# Altium schematic sheet Sheet1.SchDoc
size A3; SheetNumber: 2; SheetTotal: 2; SPICEModelCacheLIFYFCGV: <root> / <DocumentId>LIFYFCGV</DocumentId> / </root>
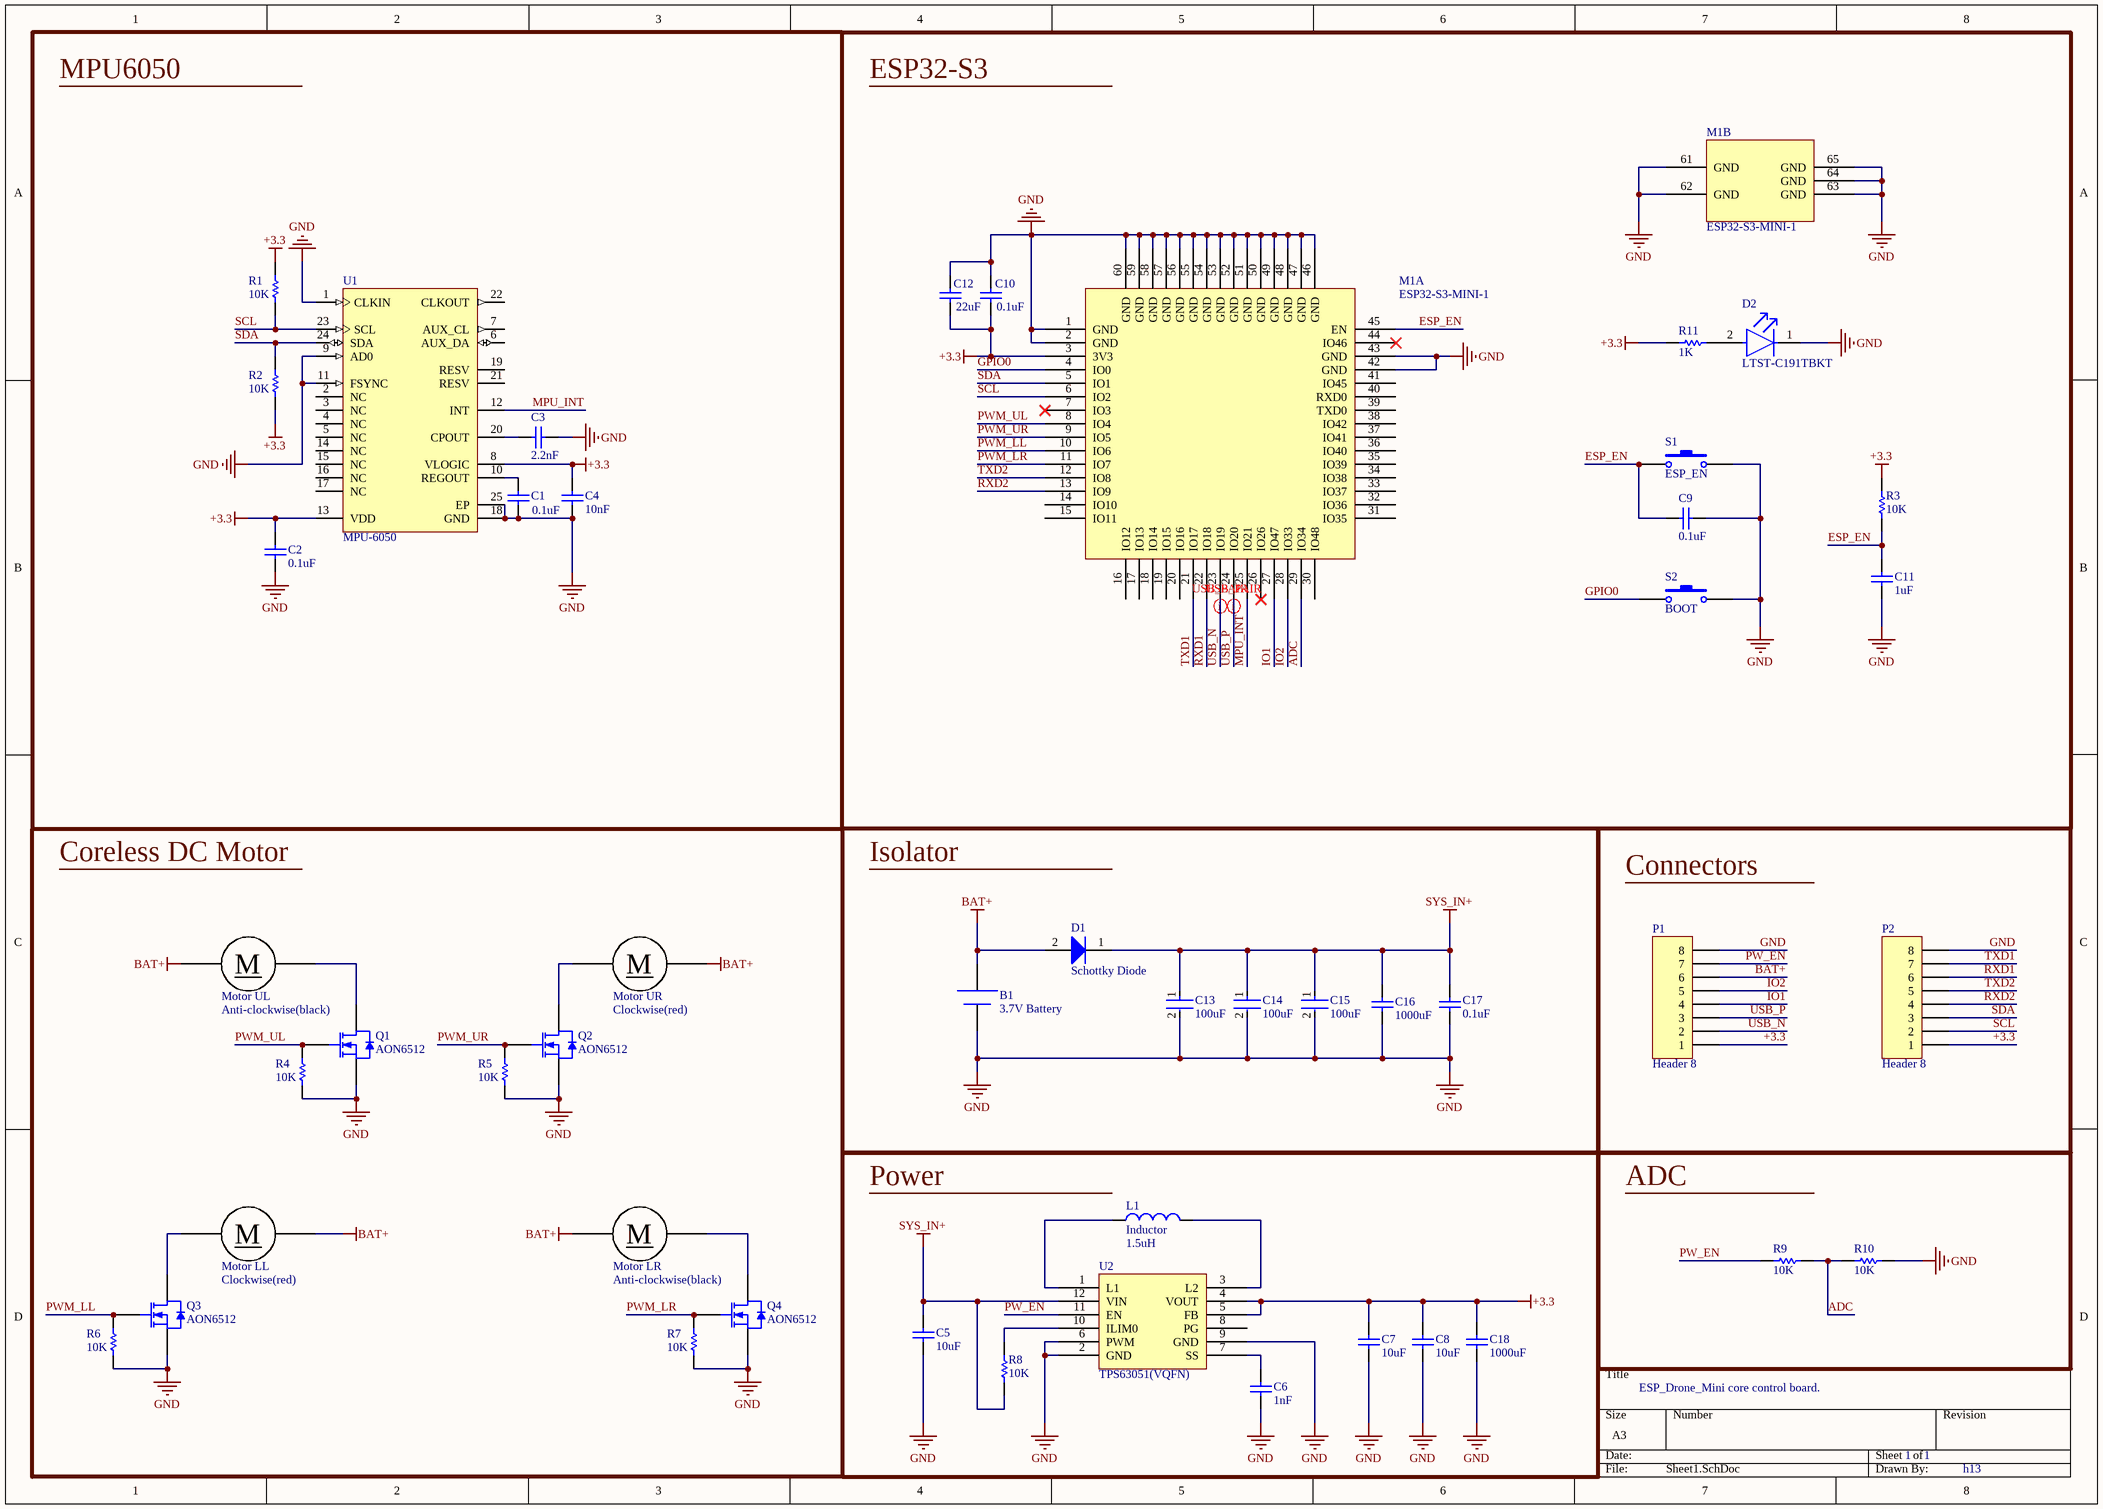
[diagram p0: Sheet1.SchDoc]

## Parts
B1  3.7V Battery  [51005 SMT 2Pin]
C1  0.1uF  [CAPC2013X94X50LL20T25]
C2  0.1uF  [CAPC2013X94X50LL20T25]
C3  2.2nF  [CAPC2013X94X50LL20T25]
C4  10nF  [CAPC2013X94X50LL20T25]
C5  10uF  [CAPC2013X94X50LL20T25]
C6  1nF  [CAPC2013X94X50LL20T25]
C7  10uF  [CAPC2013X94X50LL20T25]
C8  10uF  [CAPC2013X94X50LL20T25]
C9  0.1uF  [CAPC2013X94X50LL20T25]
C10  0.1uF  [CAPC2013X94X50LL20T25]
C11  1uF  [CAPC2013X94X50LL20T25]
C12  22uF  [CAPC2013X94X50LL20T25]
C13  100uF  [FP-C1210C107M9PACTU-MFG]
C14  100uF  [FP-C1210C107M9PACTU-MFG]
C15  100uF  [FP-C1210C107M9PACTU-MFG]
C16  value 1000uF  [SMD-EC8X8X10]  (hidden comment: Cap)
C17  0.1uF  [CAPC2013X94X50LL20T25]
C18  value 1000uF  [SMD-EC8X8X10]  (hidden comment: Cap)
D1  Schottky Diode  [ONSC-SOD-123-2-425-04_V]
D2  LTST-C191TBKT  [FP-LTST-C191TBKT-MFG]
L1  Inductor  value 1.5uH  [4020]
M1  ESP32-S3-MINI-1  [PCBComponent_1]  (parts A,B of 2)
Motor_LL  Motor DC  [HDR1X2]  (value not drawn)
Motor_LR  Motor DC  [HDR1X2]  (value not drawn)
Motor_UL  Motor DC  [HDR1X2]  (value not drawn)
Motor_UR  Motor DC  [HDR1X2]  (value not drawn)
P1  Header 8  [HDR1X8]
P2  Header 8  [HDR1X8]
Q1  AON6512  [AON6512]
Q2  AON6512  [AON6512]
Q3  AON6512  [AON6512]
Q4  AON6512  [AON6512]
R1  10K  [RESC2013X60X40LL20T25_A]
R2  10K  [RESC2013X60X40LL20T25_A]
R3  10K  [RESC2013X60X40LL20T25_A]
R4  10K  [RESC2013X60X40LL20T25_A]
R5  10K  [RESC2013X60X40LL20T25_A]
R6  10K  [RESC2013X60X40LL20T25_A]
R7  10K  [RESC2013X60X40LL20T25_A]
R8  10K  [RESC2013X60X40LL20T25_A]
R9  10K  [RESC2013X60X40LL20T25_A]
R10  10K  [RESC2013X60X40LL20T25_A]
R11  1K  [RESC2013X60X40LL20T25_A]
S1  ESP_EN  [Button SMT 3.9*2.9]
S2  BOOT  [Button SMT 3.9*2.9]
U1  MPU-6050  [IS-QFN-24_V]
U2  TPS63051(VQFN)  [RMW0012A]

## Blocks framed on the sheet
MPU6050: C1-C4 R1 R2 U1
ESP32-S3: C9-C12 D2 M1 R3 R11 S1 S2
Coreless DC Motor: Motor_LL Motor_LR Motor_UL Motor_UR Q1-Q4 R4-R7
Isolator: B1 C13-C17 D1
Connectors: P1 P2
Power: C5-C8 C18 L1 R8 U2
ADC: R9 R10

## Nets
+3.3: C2.1 C4.1 C7.2 C8.2 C10.2 C12.2 C18.1 M1.3(3V3) P1.1 P2.1 R1.2 R2.2 R3.1 R11.1 U1.8(VLOGIC) U1.13(VDD) U2.4(VOUT) U2.5(FB)
BAT+: B1.1(+) D1.2(A) Motor_LL.2 Motor_LR.1 Motor_UL.1 Motor_UR.2 P1.6
GND: B1.2(-) C1.2 C2.2 C3.1 C4.2 C5.1 C6.1 C7.1 C8.1 C9.1 C10.1 C11.2 C12.1 C13.2 C14.2 C15.2 C16.2 C17.2 C18.2 D2.1(C) M1.1(GND) M1.2(GND) M1.42(GND) M1.43(GND) M1.46(GND) M1.47(GND) M1.48(GND) M1.49(GND) M1.50(GND) M1.51(GND) M1.52(GND) M1.53(GND) M1.54(GND) M1.55(GND) M1.56(GND) M1.57(GND) M1.58(GND) M1.59(GND) M1.60(GND) M1.61(GND) M1.62(GND) M1.63(GND) M1.64(GND) M1.65(GND) P1.8 P2.8 Q1.3(SOURCE) Q2.3(SOURCE) Q3.3(SOURCE) Q4.3(SOURCE) R4.1 R5.1 R6.1 R7.1 R10.1 S1.2 S2.2 U1.1(CLKIN) U1.9(AD0) U1.11(FSYNC) U1.18(GND) U1.25(EP) U2.2(GND) U2.6(PWM) U2.9(GND)
SYS_IN+: C5.2 C13.1 C14.1 C15.1 C16.1 C17.1 D1.1(K) R8.1 U2.12(VIN)
ADC: M1.29(IO34) R9.1 R10.2
ESP_EN: C9.2 C11.1 M1.45(EN) R3.2 S1.1
GPIO0: M1.4(IO0) S2.1
IO1: M1.27(IO47) P1.4
IO2: M1.28(IO33) P1.5
MPU_INT: M1.25(IO21) U1.12(INT)
PW_EN: P1.7 R9.2 U2.11(EN)
PWM_LL: M1.10(IO6) Q3.1(GATE) R6.2
PWM_LR: M1.11(IO7) Q4.1(GATE) R7.2
PWM_UL: M1.8(IO4) Q1.1(GATE) R4.2
PWM_UR: M1.9(IO5) Q2.1(GATE) R5.2
RXD1: M1.22(IO18) P2.6
RXD2: M1.13(IO9) P2.4
SCL: M1.6(IO2) P2.2 R1.1 U1.23(SCL)
SDA: M1.5(IO1) P2.3 R2.1 U1.24(SDA)
TXD1: M1.21(IO17) P2.7
TXD2: M1.12(IO8) P2.5
USB_N: M1.23(IO19) P1.2
USB_P: M1.24(IO20) P1.3
NetC1_1: C1.1 U1.10(REGOUT)
NetC3_2: C3.2 U1.20(CPOUT)
NetC6_2: C6.2 U2.7(SS)
NetD2_2: D2.2(A) R11.2
NetL1_1: L1.1 U2.1(L1)
NetL1_2: L1.2 U2.3(L2)
NetMotor_LL_1: Motor_LL.1 Q3.2(DRAIN)
NetMotor_LR_2: Motor_LR.2 Q4.2(DRAIN)
NetMotor_UL_2: Motor_UL.2 Q1.2(DRAIN)
NetMotor_UR_1: Motor_UR.1 Q2.2(DRAIN)
NetR8_2: R8.2 U2.10(ILIM0)

Not connected (* = marked no-connect by the designer): M1 7(IO3)* 14(IO10) 15(IO11) 16(IO12) 17(IO13) 18(IO14) 19(IO15) 20(IO16) 26(IO26)* 30(IO48) 31(IO35) 32(IO36) 33(IO37) 34(IO38) 35(IO39) 36(IO40) 37(IO41) 38(IO42) 39(TXD0) 40(RXD0) 41(IO45) 44(IO46)*; U1 2(NC) 3(NC) 4(NC) 5(NC) 6(AUX_DA) 7(AUX_CL) 14(NC) 15(NC) 16(NC) 17(NC) 19(RESV) 21(RESV) 22(CLKOUT); U2 8(PG)

## Layout directives
differential pair: USB_N, USB_P

## Notes on the sheet
- (near Q1) Anti-clockwise(black)
- Clockwise(red)
- (near Q4) Anti-clockwise(black)
- ESP_Drone_Mini core control board.
- 1
- h13
- (in symbol Motor DC) M

## Library data of the parts
B1 = Battery: 3.7V; pin to pad: 1>2 2>1
C1-C12 C17 = CMP-2007-04184-1: Part Number: 08051C222JAT2A; Manufacturer: AVX Interconnect / Elco
C13-C15 = CMP-2000-06018-2: CAP CER 100UF 6.3V X5R 1210; Dissipation Factor: 5%; Dielectric Material: Ceramic; Tolerance: 20%; Termination: SMD/SMT; REACH SVHC: No SVHC; Thickness: 0.11inch; Packaging: Tape and Reel; Series: C; Width: 2.5mm; Voltage Rating (DC): 6.3V; Voltage: 6.3V; Contact Plating: Tin; Package Quantity: 1; Case/Package: 1210; Min Operating Temperature: -55°C; Height: 2.5mm; Radiation Hardening: No; Capacitance: 100uF; Case Code (Metric): 3225; Depth: 2.5mm; Construction: Flat; Max Operating Temperature: 85°C; Number of Pins: 2; Mount: Surface Mount; Lead Free: Lead Free; RoHS Compliant: Yes; Voltage Rating: 6.3V; Dielectric: X5R; Length: 3.2mm; Case Code (Imperial): 1210
C16 C18 = Cap: Capacitor; Published: 8-Jun-2000; LatestRevisionDate: 17-Jul-2002; LatestRevisionNote: Re-released for DXP Platform.; PackageReference: RAD-0.3; Publisher: Altium Limited; PackageDescription: Radial Cap, Thru-Hole; 2 Leads; 0.3 in Pin Spacing
D1 = CMP-1055-00429-1: Schottky Barrier Diode, 2-Pin SOD-123, Pb-Free, Tape and Reel; PartNumber: BAT54T1G; Manufacturer: On Semiconductor; IFSM Max (A): 0.6; trr Max (ns): 5; Configuration: Single; PackageVersion: Rev. G, 10/2009; RoHS: TRUE; PackageReference: SOD-123-2-425-04; ComponentLink2URL: http://www.onsemi.cn/pub_link/Collateral/BAT54T1-D.PDF; ComponentLink3URL: http://www.onsemi.com/pub_link/Collateral/425-04.PDF; Packing: Tape and Reel; ComponentLink3Description: Package Specification; ComponentLink1Description: Manufacturer URL; ComponentLink1URL: http://www.onsemi.com/; PackageDescription: 2-Pin SOD, Body 1.6 x 2.69 mm; ComponentLink2Description: Datasheet; Mounting Technology: Surface Mount; DatasheetVersion: Rev. 9
D2 = CMP-22017-000008-1: LED BLUE CLEAR CHIP SMD; Lens Color: Colorless; Dominant Wavelength: 475nm; Forward Current: 20mA; Wavelength: 468nm; Viewing Angle: 130°; Power Dissipation: 76mW; Luminous Intensity: 180mcd; Reverse Voltage: 5V; Number of Elements: 1; Lens Style: Diffused; Forward Voltage: 3.8V; Max Power Dissipation: 75mW; Case Code (Metric): 1608; Packaging: Tape and Reel; Case/Package: 0603; Depth: 1.6mm; Mount: Surface Mount; Lead Free: Lead Free; Min Operating Temperature: -20°C; Lens Transparency: Clear; Illumination Color: Blue; Height: 0.55mm; Test Current: 20mA; Case Code (Imperial): 0603; Max Operating Temperature: 80°C; Number of Pins: 2; Length: 0.8mm; Radiation Hardening: No; Package Quantity: 1; Number of LEDs: 1; Width: 0.8mm; Color: Blue
L1 = Inductor: Code_IEC: 1005; Published: 8-Jun-2000; LatestRevisionDate: 29-May-2009; LatestRevisionNote: IPC-7351 Footprint Added.; PackageReference: 0402-A; Publisher: Altium Limited; PackageDescription: Chip Inductor; Code_JEITA: 0402
P1 P2 = Header 8: Header, 8-Pin; LatestRevisionDate: 17-Jul-2002; LatestRevisionNote: Re-released for DXP Platform.; Publisher: Altium Limited
Q1-Q4 = CMP-1091-00211-1: N-Channel OptiMOS Power-Transistor, 60 V VDS, 100 A ID, -55 to 175 degC, PG-TO262-3-1, Tube, Green; pin to pad: 1>4 2>5 3>1+2+3; Manufacturer: Infineon; PartNumber: IPI029N06N; Ptot (max): 136Â W; ID (max): 100Â A; RthJA (max): 62 K/W; IDpuls (max): 400Â A; QG: 56Â nC; RthJC (max): 1.1Â K/W; RDS (on) (max): 2.9Â mOhm; Green: TRUE; VGS(th) (max): 3.3 V; Polarity: N; VGS(th) (min): 2.1Â V; VDS (max): 60Â V; DatasheetVersion: Rev. 2.2; ComponentLink3URL: http://www.infineon.com/dgdl/DS_IPX65R420CFD_2_4.pdf?folderId=db3a3043156fd5730115c736bcc70ff2&fileId=db3a30432f91014f012f9c293f1a7399; Mounting Technology: Through Hole; ComponentLink3Description: Package Specification; ComponentLink1Description: Manufacturer URL; PackageVersion: Rev. 03, 05/2006; ComponentLink2URL: http://www.infineon.com/dgdl/IPI029N06N_Rev2.2.pdf?folderId=db3a304313b8b5a60113cee8763b02d7&fileId=db3a30433727a44301372bab38f54926; Packing: Tube; ComponentLink2Description: Datasheet; Halogen-free: TRUE; PackageReference: PG-TO262-3-1; ComponentLink1URL: http://www.infineon.com/; Rth: 1.1Â K/W; PackageDescription: 3-Pin Plastic (Green) Transistor Single Outline Package, 10.03 x 8.98 mm Body, 2.54 mm Pitch
R1-R11 = CMP-2001-00582-2: Metal Film Chip Resistor, High Reliability Type, 0.125 W, +/- 0.1%, -55 to 155 degC, 0805 (2012 Metric), RoHS, Tape and Reel; Voltage Rating: 100V; Power Rating: 125mW(1/8W); Brand: Panasonic; Temperature Coefficient: 25PPM/C; Resistance: 10kOhms; Product Category: ThinFilmResistors-SMD; Datasheet Version: 02/2016; Operating Temperature Range: -55Cto+155C; Length: 2mm; Mounting Technology: SurfaceMount; Manufacturer URL: http://www.panasonic.com/; Width: 1.25mm; Packaging: Reel; Product: ThinFilmResistorsSMD; Package / Case: 0805(2012metric); Termination Style: SMD/SMT; Tolerance: 0.1%; Datasheet URL: https://industrial.panasonic.com/cdbs/www-data/pdf/RDM0000/AOA0000C307.pdf; Package Description: 2-Pin Surface Mount Device, Body 2 x 1.25 mm; Factory Pack Quantity: 5000; Series: ERA-6A; Case Code - mm: 2012; RoHS: Details; Package Reference: 0805; Height: 0.5mm; Manufacturer: Panasonic; Case Code - in: 0805; Type: MetalFilmChipResistors
S1 = SW-PB: Switch; Published: 24-Mar-1999; LatestRevisionDate: 17-Jul-2002; LatestRevisionNote: Re-released for DXP Platform.; PackageReference: SPST-2; Publisher: Altium Limited; PackageDescription: Switch; 2 Leads
S2 = SW-PB: Switch; pin to pad: 1>2 2>1; Published: 24-Mar-1999; LatestRevisionDate: 17-Jul-2002; LatestRevisionNote: Re-released for DXP Platform.; PackageReference: SPST-2; Publisher: Altium Limited; PackageDescription: Switch; 2 Leads
U1 = CMP-1753-00002-2: 3-Axis Gyroscope, Accelerometer and a Digital Motion Processor(TM) (DMP), 2.375 to 3.46 V, -40 to 85 degC, 24-Pin QFN, RoHS, Tape and Reel; Manufacturer: InvenSense; Featured Product: MPU-60506-Axis,IntegratedI²CSolution; Other Names: 1428-1007-2 / MPU6050; Sensor Type: MotionTracking; Online Catalog: MPU-6000™Series; Unit PriceUSD: Digital; Datasheet Version: Rev. 3.3, 05/2012; Category: Sensors,Transducers; Datasheet URL: http://datasheet.octopart.com/MPU-6050-InvenSense-datasheet-14421344.pdf; Family: Multifunction; Standard Package: 5,000; Manufacturer URL: http://www.invensense.com/; Output Type: Digital; Dynamic Catalog: MPU-6000™Series